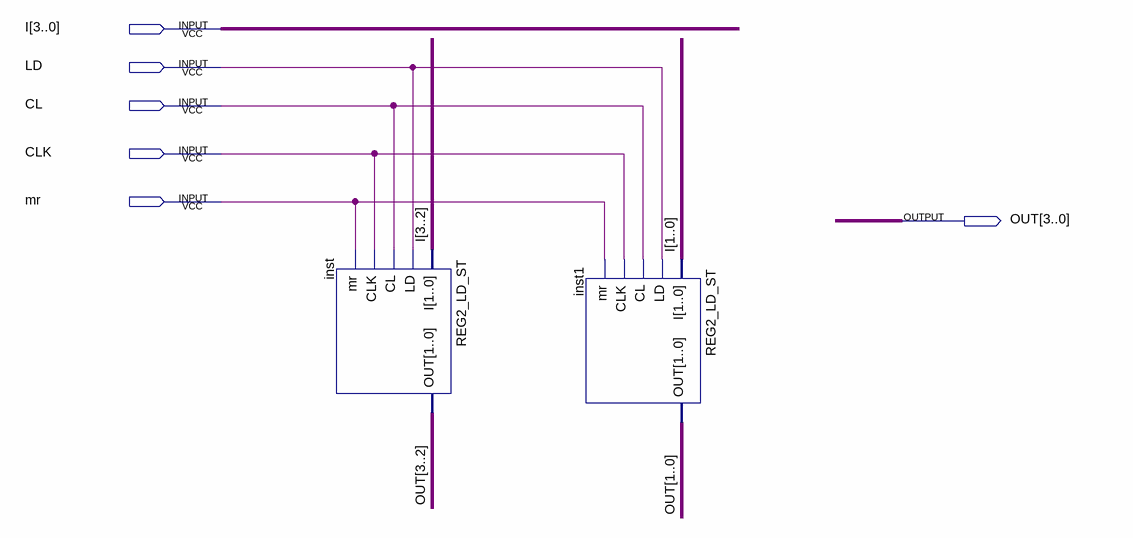
[diagram p0: schematic sheet]
// Quartus schematic REG4_LD_ST.bdf as structural Verilog: 2 symbols, 6 pins
module REG4_LD_ST (
  input  [3:0] I,
  input  LD,
  input  CL,
  input  CLK,
  input  mr,
  output [3:0] OUT
);

  REG2_LD_ST inst (.I(I[3:2]), .LD(LD), .CL(CL), .CLK(CLK), .mr(mr), .OUT(OUT[3:2]));
  REG2_LD_ST inst1 (.I(I[1:0]), .LD(LD), .CL(CL), .CLK(CLK), .mr(mr), .OUT(OUT[1:0]));
endmodule
